# Altium schematic sheet DClink.SchDoc: Servo power board
size A4; github.com/wiciu15: L3, 12a Rodborough Rd; Organization: W Burdecki; Address1: github.com/wiciu15; Address2: All rights reserved; DocumentNumber: 3; Revision: 1.0; SheetNumber: 3; SheetTotal: 3
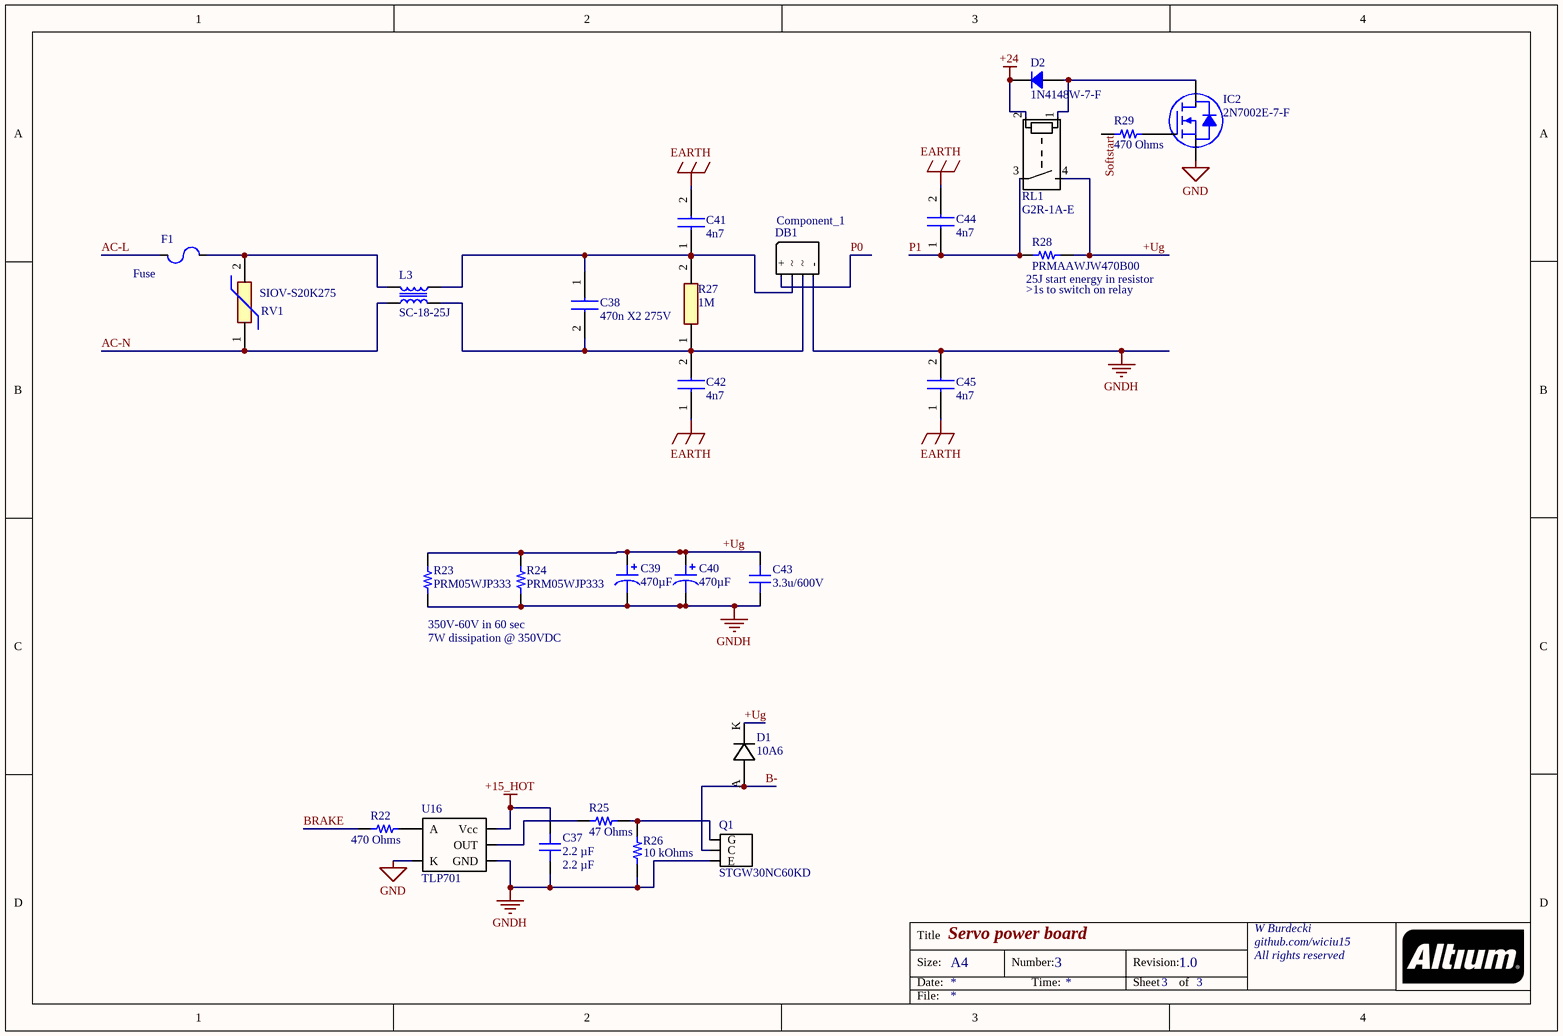
[diagram p0: DClink.SchDoc]

## Parts
C37  2.2 µF  [CAP 0805_2012]
C38  470n X2 275V  [R46KI347050M1K]
C39  470µF  [CAP TH ALUM ELEC D35.00mm S10.00mm H47.00mm]
C40  470µF  [CAP TH ALUM ELEC D35.00mm S10.00mm H47.00mm]
C41  4n7  [B32021_(13_x_5)]
C42  4n7  [B32021_(13_x_5)]
C43  3.3u/600V  [C4AQHBU4330P1WJ]
C44  4n7  [B32021_(13_x_5)]
C45  4n7  [B32021_(13_x_5)]
D1  10A6  [10A6]
D2  1N4148W-7-F  [SOD-123]
DB1  Component_1  [GBJ2506]
F1  Fuse  [FUSE]
IC2  2N7002E-7-F  [DIODES SOT-23-3]
L3  SC-18-25J  [SC18-25J]
Q1  STGW30NC60KD  [STGW30NC60KD]
R22  470 Ohms  [RES 0805_2012]
R23  PRM05WJP333  [prmaawjw470b00]
R24  PRM05WJP333  [prmaawjw470b00]
R25  47 Ohms  [RES 0805_2012]
R26  10 kOhms  [RES 0805_2012]
R27  1M  [RESAD2400W75L1000D350]
R28  PRMAAWJW470B00  [prmaawjw470b00]
R29  470 Ohms  [RES 0805_2012]
RL1  G2R-1A-E  [G2R-1A-E]
RV1  SIOV-S20K275  [B72220Q0271K101]
U16  TLP701  [TLP701]

## Nets
+15_HOT: C37.2 U16.6(Vcc)
+24: D2.2 RL1.2
EARTH: C41.2 C42.1 C44.2 C45.1
GND: IC2.2(S) U16.3(K)
GNDH: C37.1 C39.2 C40.2 C43.1 C45.2 DB1.4(-) Q1.3(E) R23.1 R24.1 R26.1 U16.4(GND)
+Ug: C39.1 C40.1 C43.2 D1.K R23.2 R24.2 R28.2 RL1.4
AC-L: F1.1
AC-N: L3.1 RV1.1
B-: D1.A Q1.2(C)
BRAKE: R22.1
P0: DB1.1(+)
P1: C44.1 R28.1 RL1.3
Softstart: R29.1
NetC38_1: C38.1 C41.1 DB1.2 L3.4 R27.2
NetC38_2: C38.2 C42.2 DB1.3 L3.2 R27.1
NetD2_1: D2.1 IC2.3(D) RL1.1
NetF1_2: F1.2 L3.3 RV1.2
NetIC2_1: IC2.1(G) R29.2
NetQ1_1: Q1.1(G) R25.2 R26.2
NetR22_2: R22.2 U16.1(A)
NetR25_1: R25.1 U16.5(OUT)

## Notes on the sheet
- (near R28) 25J start energy in resistor
- (near R28) >1s to switch on relay
- 350V-60V in 60 sec
- 7W dissipation @ 350VDC
- Title
- Size:
- Date:
- A4
- Number:
- Time:
- Revision:
- Sheet
- of
- File:

## Library data of the parts
C37 = C2012X7R1V225K125AB: CAP CER 2.2UF 35V X7R 0805; manufacturer: TDK Corporation; Tolerance: ±10%; Part Number: C2012X7R1V225K125AB; Value: 2.2 µF; Applications: General Purpose; Capacitance: 2.2 µF; componentlink1description: Datasheet; componentlink1url: https://product.tdk.com/info/en/catalog/datasheets/mlcc_commercial_general_en.pdf?ref_disty=digikey; componentlink2description: DigiKey Link; componentlink2url: https://www.digikey.com/en/products/detail/tdk-corporation/C2012X7R1V225K125AB/2732986; Device Package: 0805 (2012 Metric); lastupdated: 03.01.2023 20:10:54; Lifecycle Status: Active; Minimum Order: 1; Mounting Type: Surface Mount, MLCC; Operating Temperature: -55°C ~ 125°C; Package / Case: 0805 (2012 Metric); packaging: TapeAndReel; partid: 3412; Part Status: Active; price: 0.12; series: C; Size / Dimension: 0.079" L x 0.049" W (2.00mm x 1.25mm); Supplier 1: DigiKey; Supplier Part Number 1: 445-7551-1-ND; Temperature Coefficient: X7R; Thickness (Max): 0.057" (1.45mm); Voltage - Rated: 35V; Features: Low ESL
C38 = R46KI347050M1K: KEMET R46KI347050M1K; Datasheet Link: https://content.kemet.com/datasheets/KEM_F3093_R46_X2_275_110C.pdf; Height: 19.1mm; Manufacturer_Name: KEMET; Manufacturer_Part_Number: R46KI347050M1K; Mouser Part Number: 80-R46KI347050M1K; Mouser Price/Stock: https://www.mouser.co.uk/ProductDetail/KEMET/R46KI347050M1K?qs=D0iH%252BVFiYPOUls74bzoCnw%3D%3D; Arrow Part Number: R46KI347050M1K; Arrow Price/Stock: https://www.arrow.com/en/products/r46ki347050m1k/kemet-corporation
C39 C40 = 450HXG470MEFCSN35X45: CAP ALUM 470UF 20% 450V SNAP; manufacturer: Rubycon; Lifetime @ Temp.: 3000 Hrs @ 105°C; Polarization: Polar; Ripple Current @ High Frequency: 4.088A @ 10kHz; Ripple Current @ Low Frequency: 2.92A @ 120Hz; Part Number: 450HXG470MEFCSN35X45; Applications: General Purpose; Capacitance: 470µF; componentlink1description: Datasheet; componentlink1url: http://www.rubycon.co.jp/en/catalog/e_pdfs/aluminum/e_HXG.pdf; componentlink2description: DigiKey Link; componentlink2url: http://digikey.com/product-detail/en/rubycon/450HXG470MEFCSN35X45/1189-1975-ND/3986874; Device Package: Radial, Can - Snap-In; Height - Seated (Max): 1.850" (47.00mm); lastupdated: 29.09.2020 01:08:39; Lead Spacing: 0.394" (10.00mm); Lifecycle Status: Active; Minimum Order: 1; Mounting Type: Through Hole; Operating Temperature: -25°C ~ 105°C; Package / Case: Radial, Can - Snap-In; packaging: Bulk; partid: 26666; Part Status: Active; price: 8.55; series: HXG; Size / Dimension: 1.378" Dia (35.00mm); Supplier 1: DigiKey; Supplier Part Number 1: 1189-1975-ND; Tolerance: ±20%; value: 470µF; Voltage - Rated: 450V
C41 C42 C44 C45 = B32021A3472K289: B32021A3472; Manufacturer_Name: TDK; Datasheet Link: https://product.tdk.com/system/files/dam/doc/product/capacitor/film/emi/data_sheet/20/20/db/fc_2009/y2_b32021_026.pdf; Manufacturer_Part_Number: B32021A3472K289; Mouser Part Number: 871-B32021A3472K289; Mouser Price/Stock: https://www.mouser.co.uk/ProductDetail/EPCOS-TDK/B32021A3472K289?qs=FNSAlmj86E3UPc1%2F593FMg%3D%3D; Arrow Part Number: B32021A3472K289; Arrow Price/Stock: https://www.arrow.com/en/products/b32021a3472k289/epcos-tdk
D2 = 1N4148W-7-F: DIODE GEN PURP 100V 300MA SOD123; Manufacturer: Diodes Incorporated; Capacitance @ Vr, F: 2pF @ 0V, 1MHz; Current - Average Rectified (Io): 300mA (DC); Current - Reverse Leakage @ Vr: 1 µA @ 100 V; Diode Type: Standard; Reverse Recovery Time (trr): 4 ns; Speed: Small Signal =< 200mA (Io), Any Speed; Voltage - Forward (Vf) (Max) @ If: 1.25 V @ 150 mA; Part Number: 1N4148W-7-F; ComponentLink1Description: Datasheet; ComponentLink1URL: https://www.diodes.com/assets/Datasheets/ds30086.pdf; ComponentLink2Description: DigiKey Link; ComponentLink2URL: https://www.digikey.com/en/products/detail/diodes-incorporated/1N4148W-7-F/814371; LastUpdated: 02.01.2023 20:53:45; Lifecycle Status: Active; Minimum Order: 1; Mounting Type: Surface Mount; Operating Temperature - Junction: -55°C ~ 150°C; Package / Case: SOD-123; Packaging: TapeAndReel; PartId: 1002; Part Status: Active; Price: 0.02; Series: -; Supplier 1: DigiKey; Supplier Part Number 1: 1N4148W-FDICT-ND; Supplier Device Package: SOD-123; Voltage - DC Reverse (Vr) (Max): 100 V
F1 = Fuse: Fuse holder 04450001N
IC2 = 2N7002E-7-F: MOSFET N-CH 60V 0.25A SOT23-3; Manufacturer: Diodes Incorporated; Current - Continuous Drain (Id) @ 25°C: 250mA (Ta); Drive Voltage (Max Rds On,  Min Rds On): 4.5V, 10V; FET Type: N-Channel; Gate Charge (Qg) (Max) @ Vgs: 0.22nC @ 4.5V; Input Capacitance (Ciss) (Max) @ Vds: 50pF @ 25V; Power Dissipation (Max): 370mW (Ta); Rds On (Max) @ Id, Vgs: 3Ohm @ 250mA, 10V; Vgs (Max): ±20V; Vgs(th) (Max) @ Id: 2.5V @ 250µA; Part Number: 2N7002E-7-F; ComponentLink1Description: Datasheet; ComponentLink1URL: https://www.diodes.com/assets/Datasheets/ds30376.pdf; ComponentLink2Description: DigiKey Link; ComponentLink2URL: http://digikey.com/product-detail/en/diodes-incorporated/2N7002E-7-F/2N7002E-FDICT-ND/3877406; Drain to Source Voltage (Vdss): 60V; LastUpdated: 02.01.2023 21:04:52; Lifecycle Status: Active; Minimum Order: 1; Mounting Type: Surface Mount; Operating Temperature: -55°C ~ 150°C (TJ); Package / Case: TO-236-3, SC-59, SOT-23-3; Packaging: TapeAndReel; Part Status: Active; Price: 0.05; Series: -; Supplier 1: DigiKey; Supplier Part Number 1: 2N7002E-FDICT-ND; Supplier Device Package: SOT-23-3; Technology: MOSFET (Metal Oxide)
L3 = SC-18-25J: https://www.tme.eu/pl/details/sc-18-25j/dlawiki-pierscieniowe/kemet/
R22 R29 = ERJ-PB6B4700V: RES SMD 470 OHM 0.1% 1/4W 0805; Manufacturer: Panasonic Electronic Components; Power (Watts): 0.25W, 1/4W; Temperature Coefficient: ±50ppm/°C; Part Number: ERJ-PB6B4700V; Value: 470 Ohms; ComponentLink1Description: Datasheet; ComponentLink1URL: https://industrial.panasonic.com/cdbs/www-data/pdf/RDM0000/AOA0000C328.pdf; ComponentLink2Description: DigiKey Link; ComponentLink2URL: https://www.digikey.com/en/products/detail/panasonic-electronic-components/ERJ-PB6B4700V/6213339; Composition: Thick Film; Device Package: 0805 (2012 Metric); Features: Automotive AEC-Q200, Pulse Withstanding; Height - Seated (Max): 0.028" (0.70mm); LastUpdated: 02.01.2023 20:44:49; Lifecycle Status: Active; Minimum Order: 1; Number of Terminations: 2; Operating Temperature: -55°C ~ 155°C; Package / Case: 0805 (2012 Metric); Packaging: TapeAndReel; PartId: 28402; Part Status: Active; Price: 0.04; Ratings: AEC-Q200; Resistance: 470 Ohms; Series: ERJ-PB6; Size / Dimension: 0.079" L x 0.049" W (2.00mm x 1.25mm); Supplier 1: DigiKey; Supplier Part Number 1: P20556CT-ND; Supplier Device Package: 0805; Tolerance: ±0.1%
R25 = CRGP0805F47R: RES 47 OHM 1% 1/3W 0805; Manufacturer: TE Connectivity Passive Product; Power (Watts): 0.333W, 1/3W; Temperature Coefficient: ±200ppm/°C; Part Number: CRGP0805F47R; Value: 47 Ohms; ComponentLink1Description: Datasheet; ComponentLink1URL: https://www.te.com/commerce/DocumentDelivery/DDEController?Action=srchrtrv&DocNm=9-1773463-9&DocType=DS&DocLang=English; ComponentLink2Description: DigiKey Link; ComponentLink2URL: https://www.digikey.com/en/products/detail/te-connectivity-passive-product/CRGP0805F47R/8577063; Composition: Thick Film; Device Package: 0805 (2012 Metric); Features: Pulse Withstanding; Height - Seated (Max): 0.026" (0.65mm); LastUpdated: 02.01.2023 20:44:48; Lifecycle Status: Active; Minimum Order: 1; Number of Terminations: 2; Operating Temperature: -55°C ~ 155°C; Package / Case: 0805 (2012 Metric); Packaging: TapeAndReel; PartId: 28763; Part Status: Active; Price: 0.03; Resistance: 47 Ohms; Series: CRGP; Size / Dimension: 0.079" L x 0.049" W (2.00mm x 1.25mm); Supplier 1: DigiKey; Supplier Part Number 1: A130461CT-ND; Supplier Device Package: 0805; Tolerance: ±1%
R26 = RNCS0805BKE10K0: RES 10K OHM 0.1% 1/10W 0805; Manufacturer: Stackpole Electronics Inc; Power (Watts): 0.1W, 1/10W; Temperature Coefficient: ±25ppm/°C; Part Number: RNCS0805BKE10K0; Value: 10 kOhms; ComponentLink1Description: Datasheet; ComponentLink1URL: https://www.seielect.com/catalog/sei-rncs_rnch.pdf; ComponentLink2Description: DigiKey Link; ComponentLink2URL: https://www.digikey.com/en/products/detail/stackpole-electronics-inc/RNCS0805BKE10K0/1800067; Composition: Thin Film; Device Package: 0805 (2012 Metric); Features: Anti-Corrosive, Automotive AEC-Q200, Moisture Resistant; Height - Seated (Max): 0.026" (0.65mm); LastUpdated: 02.01.2023 20:44:52; Lifecycle Status: Active; Minimum Order: 1; Number of Terminations: 2; Operating Temperature: -55°C ~ 155°C; Package / Case: 0805 (2012 Metric); Packaging: TapeAndReel; PartId: 27713; Part Status: Active; Price: 0.09; Ratings: AEC-Q200; Resistance: 10 kOhms; Series: RNCS; Size / Dimension: 0.079" L x 0.049" W (2.00mm x 1.25mm); Supplier 1: DigiKey; Supplier Part Number 1: RNCS0805BKE10K0CT-ND; Supplier Device Package: 0805; Tolerance: ±0.1%
R27 = ROX1SJ330K: Resistor; Manufacturer_Name: TE Connectivity; Datasheet Link: http://www.te.com/commerce/DocumentDelivery/DDEController?Action=showdoc&DocId=Data+Sheet%7F1773271%7FE%7Fpdf%7FEnglish%7FENG_DS_1773271_E.pdf%7F1625886-2; Manufacturer_Part_Number: ROX1SJ330K; Mouser Part Number: 279-ROX1SJ330K; Mouser Price/Stock: http://www.mouser.com/Search/ProductDetail.aspx?qs=ip69W3eHERVe%2fUOZ1paVUg%3d%3d
R28 = PRMAAWJW470B00: https://www.tme.eu/pl/details/ax10wv-47r/rezystory-mocy/royal-ohm/prmaawjw470b00/
RL1 = G2R-1A-E: https://www.tme.eu/pl/details/g2r-1a-e-24dc/przekazniki-elektromagn-miniaturowe/omron-ocb/g2r-1a-e-24vdc/
RV1 = B72220Q0271K101: B72220S0271K101; Manufacturer_Name: TDK; Datasheet Link: https://product.tdk.com/system/files/dam/doc/product/protection/voltage/lead-disk-varistor/data_sheet/70/db/var/siov_leaded_energetiq.pdf; Height: 27mm; Manufacturer_Part_Number: B72220Q0271K101; Mouser Part Number: 871-B72220Q271K101; Mouser Price/Stock: https://www.mouser.co.uk/ProductDetail/EPCOS-TDK/B72220Q0271K101?qs=dEfas%2FXlABKTVg%252B2uP1HuA%3D%3D; Arrow Part Number: B72220Q0271K101; Arrow Price/Stock: https://www.arrow.com/en/products/b72220q0271k101/epcos-tdk